# EAGLE schematic FuenteProtoLarga_v11 (EAGLE 6.1)
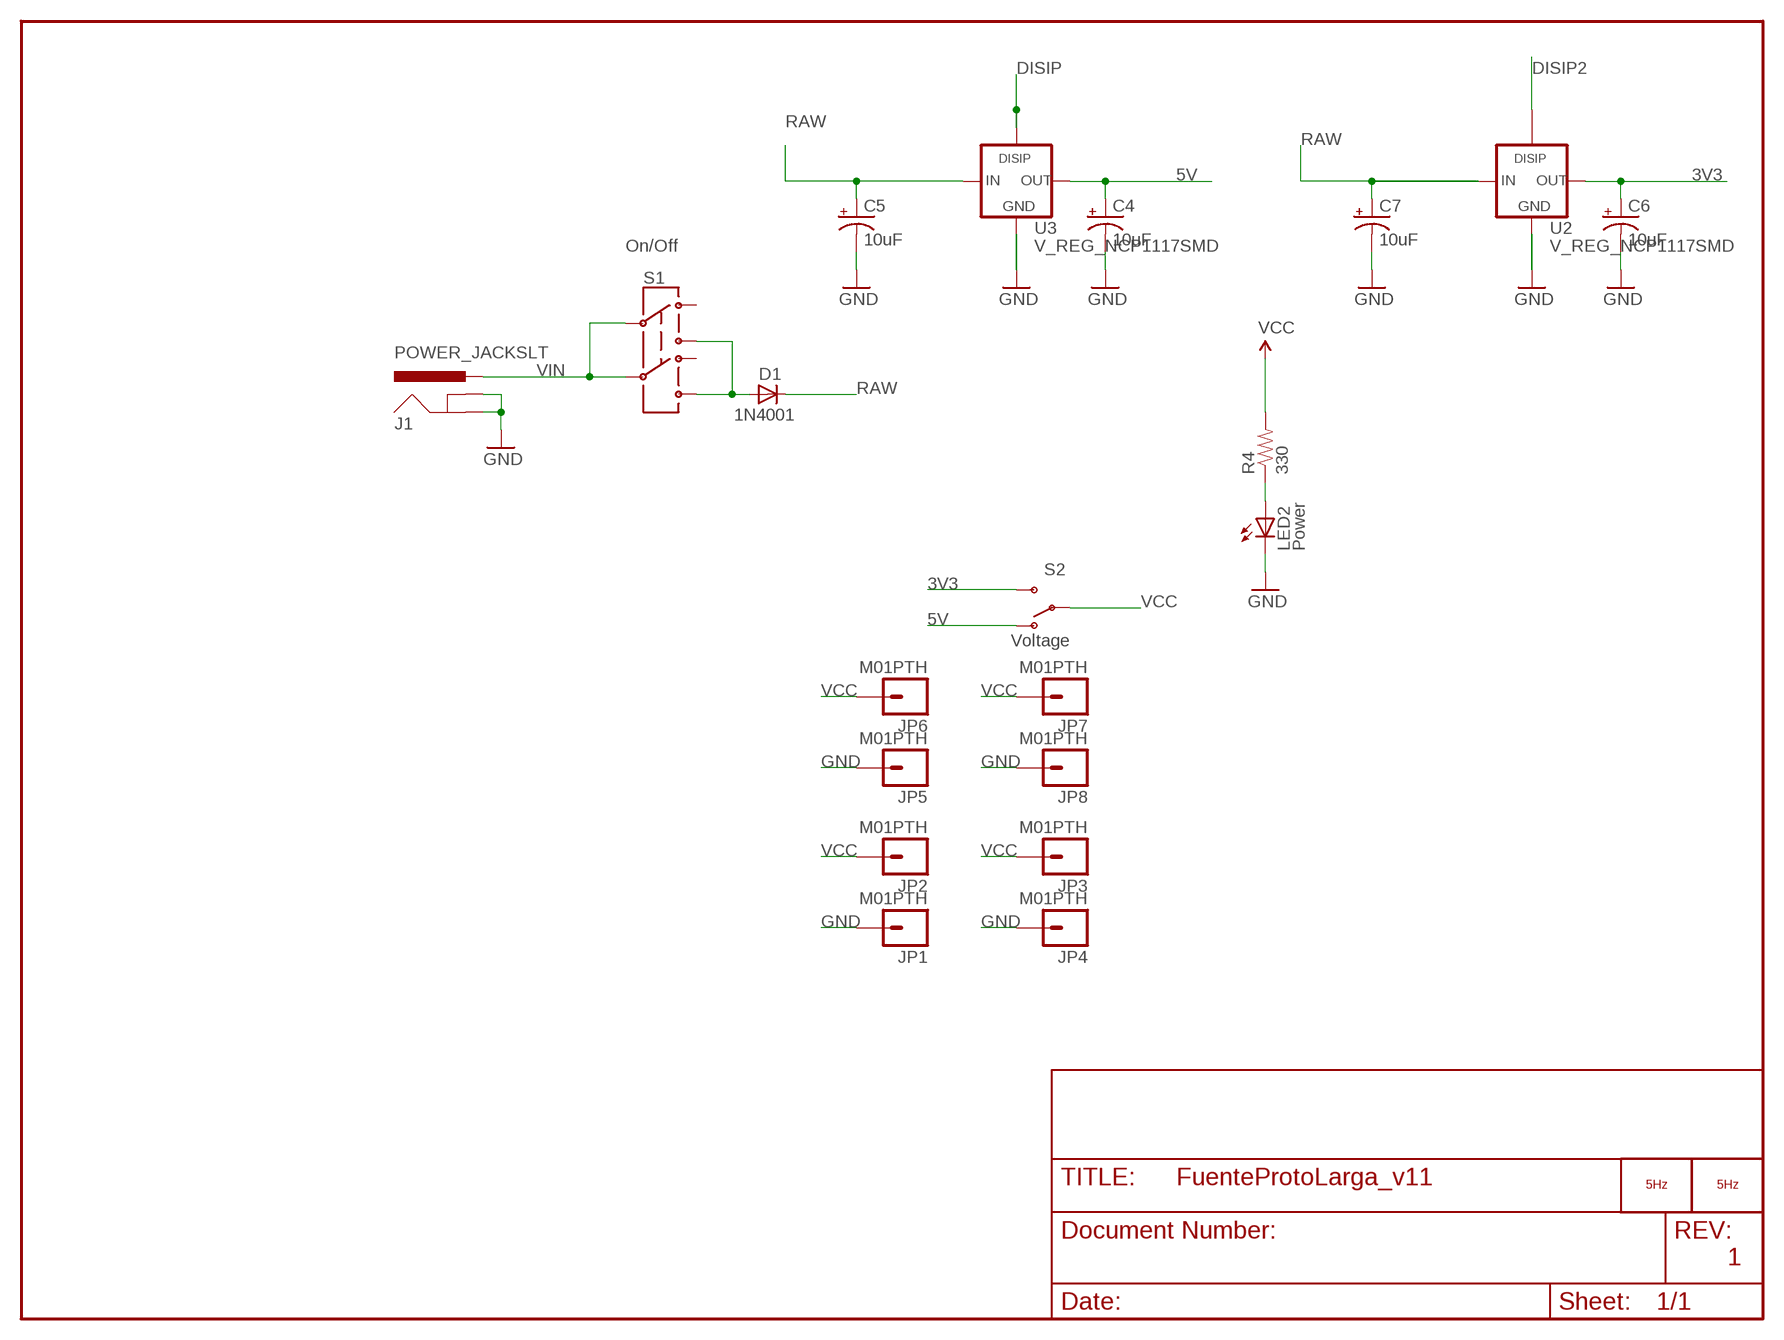
[diagram p0: schematic, sheet 1]

## Parts
C4  10uF  CAP_POL1206  [EIA3216]
C5  10uF  CAP_POL1206  [EIA3216]
C6  10uF  CAP_POL1206  [EIA3216]
C7  10uF  CAP_POL1206  [EIA3216]
D1  1N4001  DIODESMA  [SMA-DIODE]
J1  POWER_JACKSLT  [POWER_JACK_SLOT]
JP1  M01PTH  [1X01]
JP2  M01PTH  [1X01]
JP3  M01PTH  [1X01]
JP4  M01PTH  [1X01]
JP5  M01PTH  [1X01]
JP6  M01PTH  [1X01]
JP7  M01PTH  [1X01]
JP8  M01PTH  [1X01]
LED2  Power  LED0603  [LED-0603]
LOGO1  LOGO_5HZ_H_10MM  [5HZ_LOGO_H_10MM]
LOGO2  LOGO_5HZ_H_COOPER_15MM  [5HZ_LOGO_H_COOPER_15MM]
R4  330  RESISTOR0603-RES  [0603-RES]
S1  On/Off  AYZ0202  [AYZ0202]
S2  Voltage  SWITCH-SPSTSMD  [AYZ0202]
U2  V_REG_NCP1117SMD  [SOT223]
U3  V_REG_NCP1117SMD  [SOT223]

## Nets
3V3 [vcc]: C6.A(+) S2.3(S) U2.2(OUT)
5V [vcc]: C4.A(+) S2.1(O) U3.2(OUT)
DISIP: U3.4
DISIP2: U2.4
GND: C4.C(-) C5.C(-) C6.C(-) C7.C(-) J1.GND@1(GNDBREAK) J1.GND@2(GND) JP1.1 JP4.1 JP5.1 JP8.1 LED2.C U2.1(GND) U3.1(GND)
N$2: D1.A S1.1 S1.4
N$8: LED2.A R4.1
RAW: C5.A(+) C7.A(+) D1.C U2.3(IN) U3.3(IN)
VCC: JP2.1 JP3.1 JP6.1 JP7.1 R4.2 S2.2(P)
VIN: J1.PWR S1.2 S1.5
Unconnected: S1.3 S1.6

## Notes on the sheet
- 1

## Library data of the parts
C4-C7 = SparkFun:CAP_POL: Capacitor Polarized These are standard SMD and PTH capacitors. Normally 10uF, 47uF, and 100uF in electrolytic and tantalum varieties. Always verify the external diameter of the through hole cap, it varies with capacity, voltage, and manufacturer. The EIA devices should be standard.
D1 = SparkFun:DIODE: Diode These are standard reverse protection diodes and small signal diodes. SMA package can handle up to about 1A. SOD-323 can handle about 200mA. What the SOD-323 package when ordering, there are some mfgs out there that are 5-pin packages.
J1 = SparkFun:POWER_JACK: Power Jack This is the standard 5.5mm barrel jack for power. The PTH is the most common, proven, reliable, footprint. All others are experimental. The Slot footprint only works if the mill layer is transmitted to the PCB fab house so be warned. Spark Fun Electronics SKU : PRT-00119. Mating wall wart : TOL-00298 (and others)
JP1-JP8 = SparkFun:M01: Header 1 Standard 1-pin 0.1" header. Use with straight break away headers (SKU : PRT-00116), right angle break away headers (PRT-00553), swiss pins (PRT-00743), machine pins (PRT-00117), and female headers (PRT-00115).
LED2 = SparkFun-Nate:LED
LOGO1 LOGO2 = 5hz-electronica:LOGO_5HZ: Logotipo 5Hz "según Pedro"
R4 = SparkFun:RESISTOR: Resistor Basic schematic elements and footprints for 0603, 1206, and PTH resistors.
S1 = SparkFun:AYZ0202: SPDT Slide Switch Simple SMD single-pull double-throw slide switch. Good for less than 350mA power switch, switching UARTs between devices, etc. Spark Fun Electronics SKU : COM-00597
S2 = SparkFun:SWITCH-SPST: SPST Switch Simple slide switch. Spark Fun Electronics SKU : COM-00102
U2 U3 = 5hz-electronica:V_REG_NCP1117: Voltage Regulator The NCP1117 series are low dropout positive voltage regulators that are capable of providing an output current that is in excess of 1.0 A with a maximum dropout voltage of 1.2 V at 800 mA over temperature. This series contains eight fixed output voltages of 1.5 V, 1.8 V, 2.0 V, 2.5 V, 2.85 V, 3.3 V, 5.0 V, and 12 V that have no minimum load requirement to maintain regulation. Also included is an adjustable output version that can be programmed from 1.25 V to 18.8 V with two external resistors. On chip trimming adjusts the reference/output voltage to within ±1.0% accuracy. Internal protection features consist of output current limiting, safe operating area compensation, and thermal shutdown. The NCP1117 series can operate with up to 20 V input. Devices are available in SOT-223 and DPAK packages.

## Net classes
0 default: width 0.254 mm
1 vcc: width 0.254 mm